# Altium schematic sheet Temp_datalogger.SchDoc
size Legal; PageSetup: Record=PageOptions|CenterHorizontal=True|CenterVertical=True|PrintScale=1.10|XCorrection=1.00|YCorrection=1.00|PrintKind=1|BorderSize=5000000|LeftOffset=0|BottomOffset=0|Orientation=2|PaperLength=1000|PaperWidth=1000|Scale=100|PaperSource=7|PrintQuality=-4|MediaType=1|DitherType=10|PaperKind=Legal|PrintScaleMode=1
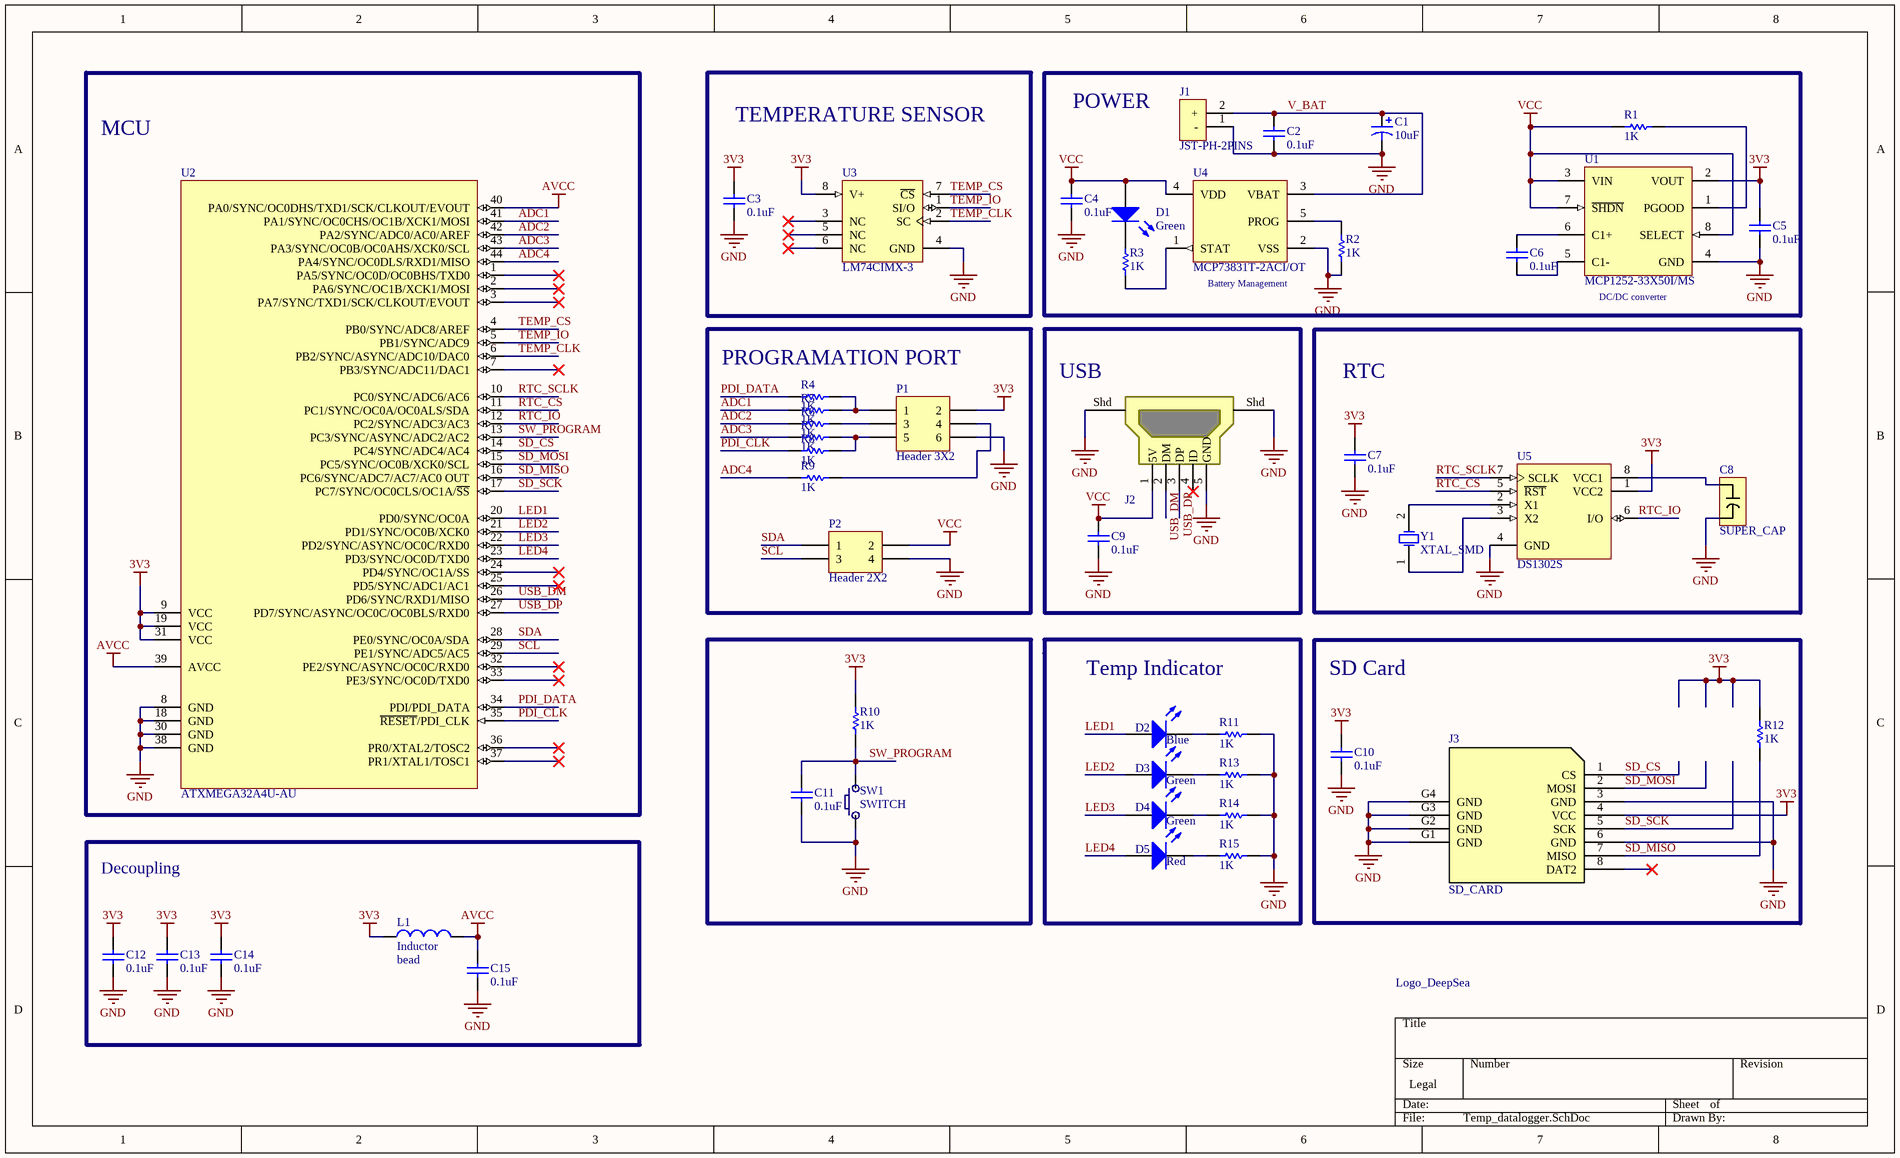
[diagram p0: Temp_datalogger.SchDoc]

## Parts
*  Logo_DeepSea  [DeepSea_logo1]
C1  10uF  [C_TANT_A_3216_N]
C2  0.1uF  [C0603_N]
C3  0.1uF  [C0603_N]
C4  0.1uF  [C0603_N]
C5  0.1uF  [C0603_N]
C6  0.1uF  [C0603_N]
C7  0.1uF  [C0603_N]
C8  SUPER_CAP  [414-VA5R]
C9  0.1uF  [C0603_N]
C10  0.1uF  [C0603_N]
C11  0.1uF  [C0603_N]
C12  0.1uF  [C0603_N]
C13  0.1uF  [C0603_N]
C14  0.1uF  [C0603_N]
C15  0.1uF  [C0603_N]
D1  Green  [R0603_N]
D2  Blue  [R0603_N]
D3  Green  [R0603_N]
D4  Green  [R0603_N]
D5  Red  [R0603_N]
J1  JST-PH-2PINS  [JST-PH-2]
J2  MINI_USB  [USB MINI]  (value not drawn)
J3  SD_CARD  [MICRO_SD-SOCKET]
L1  Inductor  value bead  [R0603_N]
P1  Header 3X2  [HDR2X3]
P2  Header 2X2  [HDR2X2]
R1  1K  [R0603_N]
R2  1K  [R0603_N]
R3  1K  [R0603_N]
R4  1K  [R0603_N]
R5  1K  [R0603_N]
R6  1K  [R0603_N]
R7  1K  [R0603_N]
R8  1K  [R0603_N]
R9  1K  [R0603_N]
R10  1K  [R0603_N]
R11  1K  [R0603_N]
R12  1K  [R0603_N]
R13  1K  [R0603_N]
R14  1K  [R0603_N]
R15  1K  [R0603_N]
SW1  SWITCH  [swich_foot]
U1  MCP1252-33X50I/MS  [MSOP-MS8_L]
U2  ATXMEGA32A4U-AU  [44A_M]
U3  LM74CIMX-3  [M08A_N]
U4  MCP73831T-2ACI/OT  [SOT-23-OT5_M]
U5  DS1302S  [SOIC8WA_N]
Y1  XTAL_SMD  [XTAL_SMD-3]

## Nets
3V3: C3.2 C5.2 C7.2 C10.1 C12.2 C13.2 C14.2 J3.4(VCC) L1.1 P1.2 R10.2 R12.2 U1.2(VOUT) U2.9(VCC) U2.19(VCC) U2.31(VCC) U3.8(V+) U5.1(VCC2)
AVCC: C15.2 L1.2 U2.39(AVCC) U2.40(PA0/SYNC/OC0DHS/TXD1/SCK/CLKOUT/EVOUT)
GND: C1.2 C2.1 C3.1 C4.1 C5.1 C7.1 C8.2 C9.1 C10.2 C11.2 C12.1 C13.1 C14.1 C15.1 J1.1(-) J2.5(GND) J2.Shd J3.3(GND) J3.6(GND) J3.G1(GND) J3.G2(GND) J3.G3(GND) J3.G4(GND) P1.6 P2.4 R2.1 R11.1 R13.1 R14.1 R15.1 SW1.1 U1.4(GND) U2.8(GND) U2.18(GND) U2.30(GND) U2.38(GND) U3.4(GND) U4.2(VSS) U5.4(GND)
VCC: C4.2 C9.2 D1.1(A) J2.1(5V) P2.2 R1.2 U1.3(VIN) U1.7(~{SHDN}) U1.8(SELECT) U4.4(VDD)
ADC1: R5.1 U2.41(PA1/SYNC/OC0CHS/OC1B/XCK1/MOSI)
ADC2: R6.1 U2.42(PA2/SYNC/ADC0/AC0/AREF)
ADC3: R7.1 U2.43(PA3/SYNC/OC0B/OC0AHS/XCK0/SCL)
ADC4: R9.1 U2.44(PA4/SYNC/OC0DLS/RXD1/MISO)
LED1: D2.1(A) U2.20(PD0/SYNC/OC0A)
LED2: D3.1(A) U2.21(PD1/SYNC/OC0B/XCK0)
LED3: D4.1(A) U2.22(PD2/SYNC/ASYNC/OC0C/RXD0)
LED4: D5.1(A) U2.23(PD3/SYNC/OC0D/TXD0)
PDI_CLK: R8.1 U2.35(~{RESET}/PDI_CLK)
PDI_DATA: R4.1 U2.34(PDI/PDI_DATA)
RTC_CS: U2.11(PC1/SYNC/OC0A/OC0ALS/SDA) U5.5(~{RST})
RTC_IO: U2.12(PC2/SYNC/ADC3/AC3) U5.6(I/O)
RTC_SCLK: U2.10(PC0/SYNC/ADC6/AC6) U5.7(SCLK)
SCL: P2.3 U2.29(PE1/SYNC/ADC5/AC5)
SD_CS: J3.1(CS) U2.14(PC4/SYNC/ADC4/AC4)
SD_MISO: J3.7(MISO) R12.1 U2.16(PC6/SYNC/ADC7/AC7/AC0_OUT)
SD_MOSI: J3.2(MOSI) U2.15(PC5/SYNC/OC0B/XCK0/SCL)
SD_SCK: J3.5(SCK) U2.17(PC7/SYNC/OC0CLS/OC1A/~{SS})
SDA: P2.1 U2.28(PE0/SYNC/OC0A/SDA)
SW_PROGRAM: C11.1 R10.1 SW1.2 U2.13(PC3/SYNC/ASYNC/ADC2/AC2)
TEMP_CLK: U2.6(PB2/SYNC/ASYNC/ADC10/DAC0) U3.2(SC)
TEMP_CS: U2.4(PB0/SYNC/ADC8/AREF) U3.7(~{CS})
TEMP_IO: U2.5(PB1/SYNC/ADC9) U3.1(SI/O)
USB_DM: J2.2(DM) U2.26(PD6/SYNC/RXD1/MISO)
USB_DP: J2.3(DP) U2.27(PD7/SYNC/ASYNC/OC0C/OC0BLS/RXD0)
V_BAT: C1.1 C2.2 J1.2(+) U4.3(VBAT)
NetC6_1: C6.1 U1.5(C1-)
NetC6_2: C6.2 U1.6(C1+)
NetC8_1: C8.1 U5.8(VCC1)
NetD1_2: D1.2(K) R3.1
NetD2_2: D2.2(K) R11.2
NetD3_2: D3.2(K) R13.2
NetD4_2: D4.2(K) R14.2
NetD5_2: D5.2(K) R15.2
NetP1_1: P1.1 R4.2 R5.2
NetP1_3: P1.3 R6.2
NetP1_4: P1.4 R9.2
NetP1_5: P1.5 R7.2 R8.2
NetR1_1: R1.1 U1.1(PGOOD)
NetR2_2: R2.2 U4.5(PROG)
NetR3_2: R3.2 U4.1(STAT)
NetU5_2: U5.2(X1) Y1.2(OSC2)
NetU5_3: U5.3(X2) Y1.1(OSC1)

Not connected (* = marked no-connect by the designer): J2 4(ID)*; J3 8(DAT2)*; U2 1(PA5/SYNC/OC0D/OC0BHS/TXD0)* 2(PA6/SYNC/OC1B/XCK1/MOSI)* 3(PA7/SYNC/TXD1/SCK/CLKOUT/EVOUT)* 7(PB3/SYNC/ADC11/DAC1)* 24(PD4/SYNC/OC1A/SS)* 25(PD5/SYNC/ADC1/AC1)* 32(PE2/SYNC/ASYNC/OC0C/RXD0)* 33(PE3/SYNC/OC0D/TXD0)* 36(PR0/XTAL2/TOSC2)* 37(PR1/XTAL1/TOSC1)*; U3 3(NC)* 5(NC)* 6(NC)*

## Notes on the sheet
- MCU
- TEMPERATURE SENSOR
- (near J1) POWER
- Battery Management
- PROGRAMATION PORT
- (near U1) DC/DC converter
- (near J2) USB
- RTC
- Temp Indicator
- SD Card
- Decoupling

## Library data of the parts
C1 = CP_SMD: Value: 10uF
C2-C7 C9-C15 = C_SMD: Value: 0.1uF
C8 = SUPER_CAP: CAP SUPER 0.06F 3.3V COIN SMD; Manufacturer: Taiyo Yuden; Manufacturer Part Number: PAS414HR-VA5R; Capacitance: 60mF; ESR (Equivalent Series Resistance): 80 Ohm; Supplier 1: Digi-Key; RoHS: RoHS Compliant; Category: Capacitors; Stock 1: 22965; Pricing 1: 1=1.18, 10=0.987, 25=0.8504, 50=0.798, 100=0.63, 250=0.525, 500=0.4725, 1000=0.4305 (USD); Packaging: Cut Tape (CT); Voltage - Rated: 3.3V; Tolerance: -; Lifetime @ Temp.: -; Mounting Type: Surface Mount; Package / Case: Coin, Wide Terminals - Same Sides; Lead Spacing: -; Size / Dimension: 0.189" Dia (4.80mm); Height - Seated (Max): 0.061" (1.55mm); Operating Temperature: -20°C ~ 60°C; ComponentLink1URL: http://www.yuden.co.jp/productdata/catalog/en/capacitor01_e.pdf; ComponentLink1Description: http://www.yuden.co.jp/productdata/catalog/en/capacitor01_e.pdf; Supplier Part Number 1: 587-2158-1-ND
D1-D5 = LED_SMD
  D1 D3 D4: Color: Green
  D2: Color: Blue
  D5: Color: Red
J1 = JST-PH-2PINS: CONN HEADER PH SIDE 2POS 2MM SMD; Manufacturer: JST Sales America Inc; Manufacturer Part Number: S2B-PH-SM4-TB(LF)(SN); Connector Type: Header, Shrouded; Number of Positions: 2; Number of Positions Loaded: All; Pitch: 0.079" (2.00mm); Supplier 1: Digi-Key; RoHS: RoHS Compliant; Category: Connectors, Interconnects; Stock 1: 51442; Pricing 1: 1=0.56, 10=0.521, 50=0.4168, 100=0.3994, 250=0.36472, 500=0.34734 (USD); Packaging: Cut Tape (CT); Contact Type: Male Pin; Number of Rows: 1; Row Spacing: -; Contact Mating Length: -; Mounting Type: Surface Mount, Right Angle; Termination: Solder; Fastening Type: -; Features: Solder Retention; Contact Finish: Tin; Contact Finish Thickness: -; Color: Natural; ComponentLink1URL: http://www.jst-mfg.com/product/pdf/eng/ePH.pdf; ComponentLink1Description: http://www.jst-mfg.com/product/pdf/eng/ePH.pdf; Supplier Part Number 1: 455-1749-1-ND
J2 = MINI_USB: CONN RCPT USB MINI B R/A SMD; Manufacturer: Hirose Electric Co Ltd; Manufacturer Part Number: UX60SC-MB-5ST(80); Number of Contacts: 5; Gender: Receptacle; Specifications: USB 2.0; Connector Type: USB - mini B; Supplier 1: Digi-Key; RoHS: RoHS Compliant; Category: Connectors, Interconnects; Stock 1: 43682; Pricing 1: 1=1.05, 10=0.813, 25=0.7576, 50=0.6876, 100=0.62, 250=0.52252, 500=0.495 (USD); Packaging: Cut Tape (CT); Mounting Type: Surface Mount, Right Angle, Horizontal; Features: Solder Retention; Ingress Protection: -; ComponentLink1URL: http://www.hirose.co.jp/cataloge_hp/e24000153.pdf; ComponentLink1Description: http://www.hirose.co.jp/cataloge_hp/e24000153.pdf; Supplier Part Number 1: H11671CT-ND
J3 = SD_CARD: CONN MEMORY CARD R/A 8POS SMD; Manufacturer: Molex Inc; Manufacturer Part Number: 0472192001; Number of Positions: 8; Connector Type: Connector and Ejector; Insertion, Removal Method: Hinged Lid; Card Type: Secure Digital - microSD™; Supplier 1: Digi-Key; RoHS: RoHS Compliant; Category: Connectors, Interconnects; Stock 1: 10625; Pricing 1: 1=1.11, 10=0.973, 25=0.916, 50=0.8776, 100=0.8395, 250=0.7632 (USD); Packaging: Cut Tape (CT); Ejector Side: -; Mounting Type: Surface Mount, Right Angle; Features: -; Height Above Board: 0.075" (1.90mm); Mounting Feature: Normal, Standard - Top; Contact Finish: Gold; Contact Finish Thickness: 20µin (0.51µm); ComponentLink1URL: http://www.molex.com/pdm_docs/sd/472192001_sd.pdf; ComponentLink1Description: http://www.molex.com/pdm_docs/sd/472192001_sd.pdf; Supplier Part Number 1: WM6698CT-ND
L1 = Inductor: Code_IEC: 1005; Published: 8-Jun-2000; LatestRevisionDate: 29-May-2009; LatestRevisionNote: IPC-7351 Footprint Added.; PackageReference: 0402-A; Publisher: Altium Limited; PackageDescription: Chip Inductor; Code_JEITA: 0402
P1 = Header 3X2: Header, 3-Pin, Dual row; LatestRevisionDate: 17-Jul-2002; LatestRevisionNote: Re-released for DXP Platform.; Publisher: Altium Limited
P2 = Header 2X2: Header, 2-Pin, Dual row; LatestRevisionDate: 17-Jul-2002; LatestRevisionNote: Re-released for DXP Platform.; Publisher: Altium Limited
R1-R15 = R_SMD: Value: 1K
SW1 = SWITCH: SWITCH TACTILE SPST-NO 0.05A 12V; Manufacturer: TE Connectivity; Manufacturer Part Number: FSM4JSMATR; Switch Function: Off-Mom; Contact Rating @ Voltage: 0.05A @ 12VDC; Actuator Type: Standard; Actuator Height off PCB, from Pins: 5.00mm; Actuator Orientation: Top Actuated; Outline: 6.00mm x 6.00mm; Illumination: Non-Illuminated; Operating Force: 160gf; Actuator Material: Polyphenylene Sulfide (PPS); Switch Travel: 0.25mm; Mechanical Life: 100,000 Cycles; Supplier 1: Digi-Key; RoHS: RoHS Compliant; Category: Switches; Stock 1: 33712; Pricing 1: 1=0.23, 10=0.223, 25=0.2136, 50=0.2038, 100=0.1843, 250=0.1698, 500=0.15524 (USD); Packaging: Cut Tape (CT); Circuit: SPST-NO; Mounting Type: Surface Mount; Termination Style: Gull Wing; Illumination Voltage (Nominal): -; Illumination Type, Color: -; Ingress Protection: -; Features: -; Operating Temperature: -35°C ~ 85°C; ComponentLink1URL: http://www.te.com/commerce/DocumentDelivery/DDEController?Action=srchrtrv&DocNm=2-1437565-7&DocType=Customer+Drawing&DocLang=English; ComponentLink1Description: http://www.te.com/commerce/DocumentDelivery/DDEController?Action=srchrtrv&DocNm=2-1437565-7&DocType=Customer+Drawing&DocLang=English; Supplier Part Number 1: 450-1759-1-ND
U1 = MCP1252-33X50I/MS: IC REG MULTI CONFIG 0.12A 8MSOP; Manufacturer: Microchip Technology; Output Type: Fixed; Number of Outputs: 1; Voltage - Output: 3.3V, 5V; Voltage - Input: 2 V ~ 5.5 V; Frequency - Switching: 650kHz; Current - Output: 120mA; Synchronous Rectifier: No; Supplier 1: Digi-Key; RoHS: RoHS Compliant; Category: Integrated Circuits (ICs); Stock 1: 1865; Pricing 1: 1=1.64, 10=1.37, 25=1.14, 100=1.04 (USD); Packaging: Tube; Type: Step-Down (Buck), Step-Up (Boost), Switched Capacitor (Charge Pump); PWM Type: -; Operating Temperature: -40°C ~ 85°C; Mounting Type: Surface Mount; Package / Case: 8-TSSOP, 8-MSOP (0.118", 3.00mm Width); Supplier Device Package: 8-MSOP; ComponentLink1URL: http://www.microchip.com/mymicrochip/filehandler.aspx?ddocname=en011637; ComponentLink1Description: http://www.microchip.com/mymicrochip/filehandler.aspx?ddocname=en011637; Supplier Part Number 1: MCP1252-33X50I/MS-ND; Manufacturer Part Number: MCP1252-33X50I/MS
U2 = ATXMEGA32A4U-AU: IC MCU 8BIT 32KB FLASH 44TQFP; Manufacturer: Atmel; Core Processor: AVR; Core Size: 8/16-Bit; Speed: 32MHz; Connectivity: I²C, IrDA, SPI, UART/USART, USB; Peripherals: Brown-out Detect/Reset, DMA, POR, PWM, WDT; Number of I /O: 34; Program Memory Size: 32KB (16K x 16); EEPROM Size: 2K x 8; RAM Size: 4K x 8; Voltage - Supply (Vcc/Vdd): 1.6 V ~ 3.6 V; Data Converters: A/D 12x12b, D/A 2x12b; Oscillator Type: Internal; Supplier 1: Digi-Key; RoHS: RoHS Compliant; Category: Integrated Circuits (ICs); Stock 1: 2077; Pricing 1: 1=3.43, 25=2.1548, 100=1.9152 (USD); Packaging: Tray; Program Memory Type: FLASH; Operating Temperature: -40°C ~ 85°C; Package / Case: 44-TQFP; ComponentLink1URL: http://www.atmel.com/Images/Atmel-8387-8-and16-bit-AVR-Microcontroller-XMEGA-A4U_Datasheet.pdf; ComponentLink1Description: http://www.atmel.com/Images/Atmel-8387-8-and16-bit-AVR-Microcontroller-XMEGA-A4U_Datasheet.pdf; Supplier Part Number 1: ATXMEGA32A4U-AU-ND; Manufacturer Part Number: ATXMEGA32A4U-AU
U3 = LM74CIMX-3: SPI/MICROWIRE 12-Bit Plus Sign Temperature Sensor, 8-pin Narrow SOIC; Manufacturer: National Semiconductor; PackageTopMarking: NSZXTT*LM74*CIM3; PowerWise: N; CompType: Temp Sensor IC; Published: 1-Mar-2010; DatasheetVersion: May-2005; PackageVersion: revM, May-2009; PackageReference: M08A; Publisher: Altium Limited; PackageDescription: SOIC Narrow, 4.9 x 3.9 x 1.45mm, 8 Lead, 1.27mm Pitch; Supplier 1: Digi-Key; Supplier Part Number 1: LM74CIMX-3TR-ND; Supplier 2: Digi-Key; Supplier Part Number 2: LM74CIMX-3CT-ND; PartNumber: LM74CIMX-3; RoHS: N; PinCount: 8; Code_JEDEC: MS-012-AA; Code_IPC: SOIC127P600-8; ComponentLink1Description: LM74 Datasheet; ComponentLink1URL: http://www.national.com/ds/LM/LM74.pdf; ComponentLink2Description: LM74 Web Page; ComponentLink2URL: http://www.national.com/pf/LM/LM74.html; ComponentLink3Description: M08A Package Page; ComponentLink3URL: http://www.national.com/packaging/folders/m08a.html
U4 = MCP73831T-2ACI/OT: IC CONTROLLR LI-ION 4.2V SOT23-5; Manufacturer: Microchip Technology; Function: Charge Management; Battery Chemistry: Li-Ion, Li-Pol; Voltage - Supply: 3.75 V ~ 6 V; Supplier 1: Digi-Key; RoHS: RoHS Compliant; Category: Integrated Circuits (ICs); Stock 1: 15473; Pricing 1: 1=0.67, 10=0.56, 25=0.47, 100=0.42 (USD); Packaging: Cut Tape (CT); Operating Temperature: -40°C ~ 85°C; Mounting Type: Surface Mount; Package / Case: SC-74A, SOT-753; Supplier Device Package: SOT-23-5; ComponentLink1URL: http://www.microchip.com/mymicrochip/filehandler.aspx?ddocname=en025112; ComponentLink1Description: http://www.microchip.com/mymicrochip/filehandler.aspx?ddocname=en025112; Supplier Part Number 1: MCP73831T-2ACI/OTCT-ND; Manufacturer Part Number: MCP73831T-2ACI/OT
U5 = DS1302S: IC TIMEKEEPER T-CHARGE 8-SOIC; Manufacturer: Maxim Integrated; Manufacturer Part Number: DS1302S+T&R; Memory Size: 31B; Time Format: HH:MM:SS (12/24 hr); Date Format: YY-MM-DD-dd; Interface: 3-Wire Serial; Voltage - Supply: 2 V ~ 5.5 V; Supplier 1: Digi-Key; RoHS: RoHS Compliant; Category: Integrated Circuits (ICs); Stock 1: 2031; Pricing 1: 1=3.05, 10=2.882, 25=2.3052, 50=2.19, 100=2.0171, 250=1.91332, 500=1.84416 (USD); Packaging: Cut Tape (CT); Type: Clock/Calendar; Features: Leap Year, NVSRAM, Trickle-Charger; Voltage - Supply, Battery: 2 V ~ 5.5 V; Operating Temperature: 0°C ~ 70°C; Mounting Type: Surface Mount; Package / Case: 8-SOIC (0.209", 5.30mm Width); Supplier Device Package: 8-SO; ComponentLink1URL: http://datasheets.maximintegrated.com/en/ds/DS1302.pdf; ComponentLink1Description: http://datasheets.maximintegrated.com/en/ds/DS1302.pdf; Supplier Part Number 1: DS1302S